# Altium schematic sheet QSFP_uptoQSFP56.SchDoc
size A3
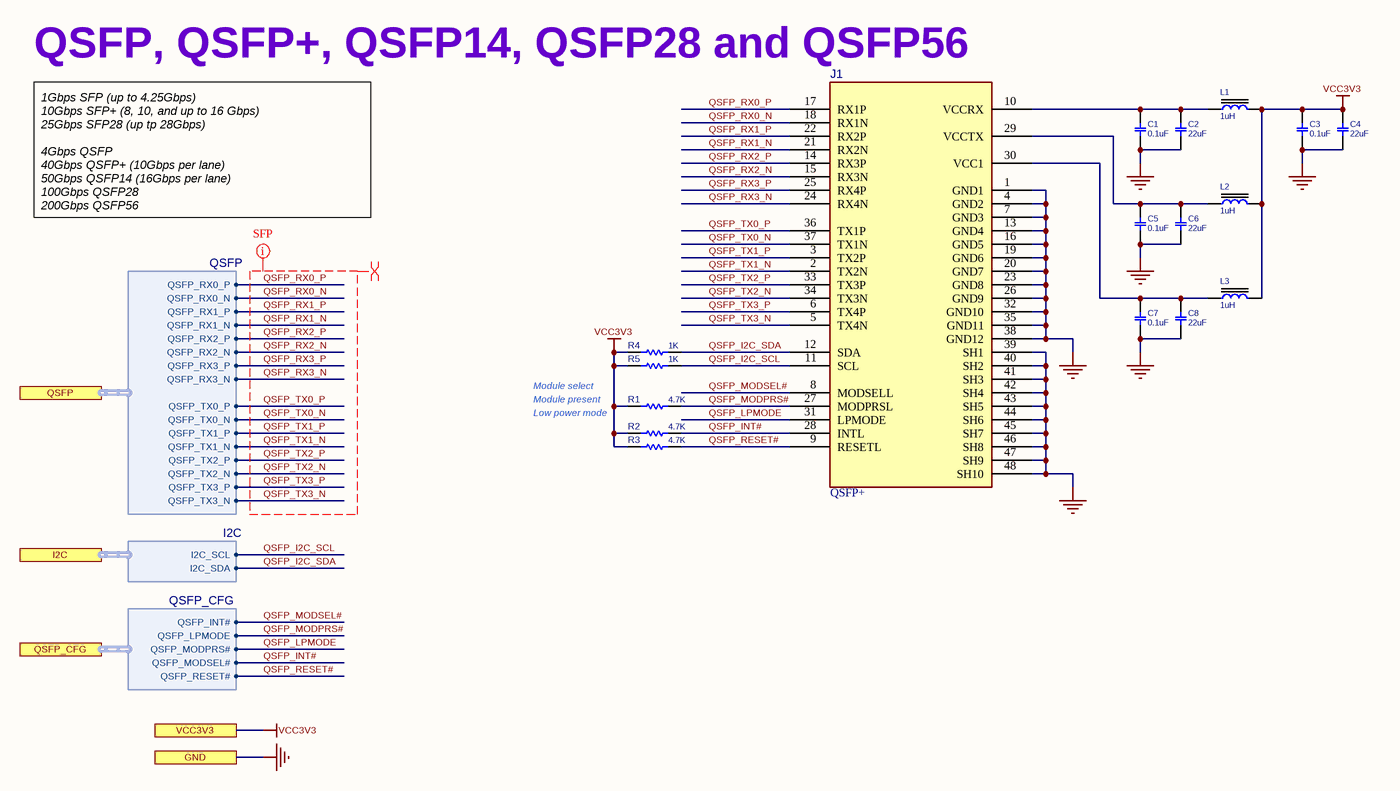
[diagram p0: QSFP_uptoQSFP56.SchDoc]

## Parts
C1  0.1uF  [C0402]
C2  22uF  [C0603]
C3  0.1uF  [C0402]
C4  22uF  [C0603]
C5  0.1uF  [C0402]
C6  22uF  [C0603]
C7  0.1uF  [C0402]
C8  22uF  [C0603]
J1  QSFP+  [QSFP28_38_SH]
L1  1uH  [L0806]
L2  1uH  [L0806]
L3  1uH  [L0806]
R1  4.7K  [R0402]
R2  4.7K  [R0402]
R3  4.7K  [R0402]
R4  1K  [R0402]
R5  1K  [R0402]

## Ports
GND, I2C (harness I2C), QSFP (harness QSFP), QSFP_CFG (harness QSFP_CFG), VCC3V3

## Harnesses
QSFP_CFG: QSFP_INT#, QSFP_LPMODE, QSFP_MODPRS#, QSFP_MODSEL#, QSFP_RESET#
I2C: I2C_SCL, I2C_SDA
QSFP: QSFP_RX0_P, QSFP_RX0_N, QSFP_RX1_P, QSFP_RX1_N, QSFP_RX2_P, QSFP_RX2_N, QSFP_RX3_P, QSFP_RX3_N, QSFP_TX0_P, QSFP_TX0_N, QSFP_TX1_P, QSFP_TX1_N, QSFP_TX2_P, QSFP_TX2_N, QSFP_TX3_P, QSFP_TX3_N

## Nets
GND: C1.2 C2.2 C3.1 C4.2 C5.1 C6.2 C7.1 C8.2 J1.1(GND1) J1.4(GND2) J1.7(GND3) J1.13(GND4) J1.16(GND5) J1.19(GND6) J1.20(GND7) J1.23(GND8) J1.26(GND9) J1.32(GND10) J1.35(GND11) J1.38(GND12) J1.39(SH1) J1.40(SH2) J1.41(SH3) J1.42(SH4) J1.43(SH5) J1.44(SH6) J1.45(SH7) J1.46(SH8) J1.47(SH9) J1.48(SH10) ; port GND
VCC3V3: C3.2 C4.1 L1.2 L2.2 L3.2 R1.2 R2.2 R3.2 R4.1 R5.1 ; port VCC3V3
QSFP_I2C_SCL: J1.11(SCL) R5.2 ; port I2C.I2C_SCL
QSFP_I2C_SDA: J1.12(SDA) R4.2 ; port I2C.I2C_SDA
QSFP_INT#: J1.28(INTL) R2.1 ; port QSFP_CFG.QSFP_MODSEL#
QSFP_LPMODE: J1.31(LPMODE) ; port QSFP_CFG.QSFP_MODPRS#
QSFP_MODPRS#: J1.27(MODPRSL) R1.1 ; port QSFP_CFG.QSFP_LPMODE
QSFP_MODSEL#: J1.8(MODSELL) ; port QSFP_CFG.QSFP_INT#
QSFP_RESET#: J1.9(RESETL) R3.1 ; port QSFP_CFG.QSFP_RESET#
QSFP_RX0_N: J1.18(RX1N) ; port QSFP.QSFP_RX0_N
QSFP_RX0_P: J1.17(RX1P) ; port QSFP.QSFP_RX0_P
QSFP_RX1_N: J1.21(RX2N) ; port QSFP.QSFP_RX1_N
QSFP_RX1_P: J1.22(RX2P) ; port QSFP.QSFP_RX1_P
QSFP_RX2_N: J1.15(RX3N) ; port QSFP.QSFP_RX2_N
QSFP_RX2_P: J1.14(RX3P) ; port QSFP.QSFP_RX2_P
QSFP_RX3_N: J1.24(RX4N) ; port QSFP.QSFP_RX3_N
QSFP_RX3_P: J1.25(RX4P) ; port QSFP.QSFP_RX3_P
QSFP_TX0_N: J1.37(TX1N) ; port QSFP.QSFP_TX0_N
QSFP_TX0_P: J1.36(TX1P) ; port QSFP.QSFP_TX0_P
QSFP_TX1_N: J1.2(TX2N) ; port QSFP.QSFP_TX1_N
QSFP_TX1_P: J1.3(TX2P) ; port QSFP.QSFP_TX1_P
QSFP_TX2_N: J1.34(TX3N) ; port QSFP.QSFP_TX2_N
QSFP_TX2_P: J1.33(TX3P) ; port QSFP.QSFP_TX2_P
QSFP_TX3_N: J1.5(TX4N) ; port QSFP.QSFP_TX3_N
QSFP_TX3_P: J1.6(TX4P) ; port QSFP.QSFP_TX3_P
NetC1_1: C1.1 C2.1 J1.10(VCCRX) L1.1
NetC5_2: C5.2 C6.1 J1.29(VCCTX) L2.1
NetC7_2: C7.2 C8.1 J1.30(VCC1) L3.1

## Layout directives
differential pair: QSFP_RX0_N, QSFP_RX0_P, QSFP_RX1_N, QSFP_RX1_P, QSFP_RX2_N, QSFP_RX2_P, QSFP_RX3_N, QSFP_RX3_P, QSFP_TX0_N, QSFP_TX0_P, QSFP_TX1_N, QSFP_TX1_P, QSFP_TX2_N, QSFP_TX2_P, QSFP_TX3_N, QSFP_TX3_P
net class SFP: QSFP_RX0_N, QSFP_RX0_P, QSFP_RX1_N, QSFP_RX1_P, QSFP_RX2_N, QSFP_RX2_P, QSFP_RX3_N, QSFP_RX3_P, QSFP_TX0_N, QSFP_TX0_P, QSFP_TX1_N, QSFP_TX1_P, QSFP_TX2_N, QSFP_TX2_P, QSFP_TX3_N, QSFP_TX3_P

## Notes on the sheet
- (near J1) QSFP, QSFP+, QSFP14, QSFP28 and QSFP56
- 1Gbps SFP (up to 4.25Gbps)
  10Gbps SFP+ (8, 10, and up to 16 Gbps)
  25Gbps SFP28 (up tp 28Gbps)
  4Gbps QSFP
  40Gbps QSFP+ (10Gbps per lane)
  50Gbps QSFP14 (16Gbps per lane)
  100Gbps QSFP28
  200Gbps QSFP56
- Module select
- Module present
- Low power mode
- Title
- Size:
- Date:
- A3
- Number:
- Time:
- Revision:
- Sheet
- of
- File:

## Library data of the parts
C1 C3 C5 C7 = CAP_SMD_MLCC_100n50T: CAP, MLCC, 100nF, 50V, X7R, 10%, 0402C; MANF: Taiyo Yuden; MANF_P#: UMK105B7104KVHF; PARAM: 50V; DESC: CAP, MLCC, 100nF, 50V, X7R, 10%, 0402C; PARAM2: X7R, 10%; ASSEMBLY: ASSEMBLY; PRICE: 100= 5$; VALUE: 0.1uF
C2 C4 C6 C8 = CAP_SMD_MLCC_100u6.3VT: CAP, MLCC, X5R 22uF 20% 25V; MANF_P#: JMK325BJ107MM-T; MANF: Taiyo Yuden; PARAM: X5R, 20%, -55~85oC; PARAM2: 25v; PRICE: 100= 45$; VALUE: 22uF
J1 = CONN_QSFP_38_SH: CONN, QSFP PLUS (SFP+) RCPT 20POS R/A GOLD SMD; MANF: Samtec; MANF_P#: QSFPK-PF-01; PARAM: optic fiber, QSFP+; PRICE: 7$; VALUE: QSFP+
L1-L3 = IND_SMD_2.2uH_2.9A: INDUCTOR; PARAM: 2.7A, 3.6A (Isat); MANF_P#: DFE201610E-1R0M; MANF: Murata; PARAM2: 57mOhm, -40~125oC; PRICE: -; ASSEMBLY: ASSEMBLY; VALUE: 1uH
R1-R3 = RES_SMD_10K_0402: RESISTOR, SMD; MANF: Yageo; PARAM: 0.063W; DESC: DESCRIPTION; DIST#: MOUSER; PARAM2: 1%; MANF_P#: RC0402FR-074K7L; ASSEMBLY: ASSEMBLY; PRICE: 100= 0.3$; VALUE: 4.7K
R4 R5 = RES_SMD_0_0402: RESISTOR, SMD; MANF_P#: RK73Z1ETTP; MANF: KOA SPEER; PARAM: 0.063W; DESC: DESCRIPTION; DIST#: MOUSER; PARAM2: 1%; ASSEMBLY: ASSEMBLY; PRICE: 100= 0.8$; VALUE: 1K